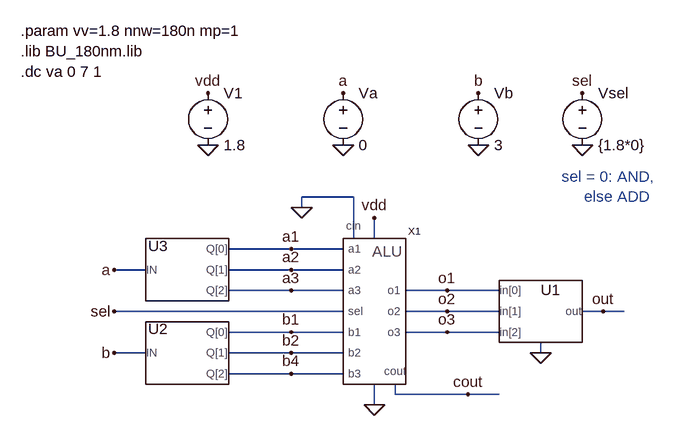
[diagram p0: schematic alu_test_dc.asc]
alu_test_dc.asc, the LTspice schematic file:
Version 4
SHEET 1 936 680
WIRE 368 64 288 64
WIRE 288 80 288 64
WIRE 368 128 368 64
WIRE 400 128 400 96
WIRE 272 144 176 144
WIRE 352 144 272 144
WIRE 48 176 0 176
WIRE 272 176 176 176
WIRE 352 176 272 176
WIRE 272 208 176 208
WIRE 352 208 272 208
WIRE 512 208 448 208
WIRE 592 208 512 208
WIRE 352 240 0 240
WIRE 512 240 448 240
WIRE 592 240 512 240
WIRE 752 240 720 240
WIRE 784 240 752 240
WIRE 272 272 176 272
WIRE 352 272 272 272
WIRE 512 272 448 272
WIRE 592 272 512 272
WIRE 48 304 0 304
WIRE 272 304 176 304
WIRE 352 304 272 304
WIRE 656 304 656 288
WIRE 272 336 176 336
WIRE 352 336 272 336
WIRE 432 368 432 352
WIRE 544 368 432 368
WIRE 592 368 544 368
WIRE 400 384 400 352
FLAG 752 240 out
FLAG 400 96 vdd
FLAG 400 384 0
FLAG 144 -16 0
FLAG 352 -16 0
FLAG 560 -16 0
FLAG 144 -96 vdd
FLAG 352 -96 a
FLAG 560 -96 b
FLAG 0 176 a
FLAG 0 304 b
FLAG 720 -16 0
FLAG 720 -96 sel
FLAG 0 240 sel
FLAG 288 80 0
FLAG 544 368 cout
FLAG 512 208 o1
FLAG 512 240 o2
FLAG 512 272 o3
FLAG 272 144 a1
FLAG 272 176 a2
FLAG 272 208 a3
FLAG 272 272 b1
FLAG 272 304 b2
FLAG 272 336 b4
FLAG 656 304 0
SYMBOL alu 400 240 R0
SYMATTR InstName X1
SYMBOL Bin2Dec 656 240 R0
SYMATTR InstName U1
SYMATTR SpiceLine Vhigh={vv}
SYMBOL Dec2Bin 112 304 R0
SYMATTR InstName U2
SYMATTR SpiceLine Vhigh={vv}
SYMBOL Dec2Bin 112 176 R0
SYMATTR InstName U3
SYMATTR SpiceLine Vhigh={vv}
SYMBOL /voltage 144 -112 R0
SYMATTR InstName V1
SYMATTR Value 1.8
SYMBOL /voltage 352 -112 R0
SYMATTR InstName Va
SYMATTR Value 0
SYMBOL /voltage 560 -112 R0
SYMATTR InstName Vb
SYMATTR Value 3
SYMBOL /voltage 720 -112 R0
SYMATTR InstName Vsel
SYMATTR Value {1.8*0}
TEXT -144 -192 Left 2 !.param vv=1.8 nnw=180n mp=1\n.lib BU_180nm.lib\n.dc va 0 7 1
TEXT 688 32 Left 2 ;sel = 0: AND,\n     else ADD

The netlist it stands for:
* alu_test_dc.asc
XX1 vdd a1 a2 a3 b1 b2 b4 0 o1 o2 o3 sel cout 0 alu  ; pins vdd a1 a2 a3 b1 b2 b3 vss o1 o2 o3 sel cout cin
XU1 o1 o2 o3 out Bin2Dec Vhigh={vv}  ; pins in[0] in[1] in[2] out
XU2 b b1 b2 b4 Dec2Bin Vhigh={vv}  ; pins IN Q[0] Q[1] Q[2]
XU3 a a1 a2 a3 Dec2Bin Vhigh={vv}  ; pins IN Q[0] Q[1] Q[2]
V1 vdd 0 1.8
Va a 0 0
Vb b 0 3
Vsel sel 0 {1.8*0}
.param vv=1.8 nnw=180n mp=1
.lib BU_180nm.lib
.dc va 0 7 1
* sel = 0: AND,
*      else ADD
.lib alu.asc
.lib Bin2Dec.sub
.lib Dec2Bin.sub
.backanno
.end

* Results of the author's LTspice run, read from the files saved beside the schematic
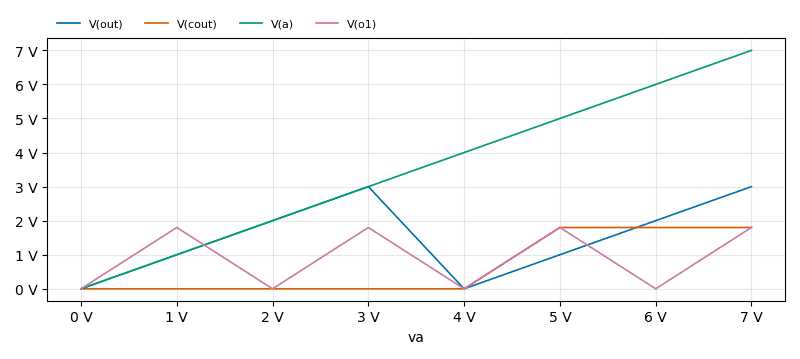
[diagram p1: DC transfer characteristic of alu_test_dc.asc, plotted from the saved traces]
* DC transfer characteristic, 1 run:
*   V(out): 0 V at va=0 V, 3 V at va=7 V, min 0 V, max 3 V
*   V(cout): 1.253 µV at va=0 V, 1.8 V at va=7 V, min 1.253 µV, max 1.8 V
*   V(a): 0 V at va=0 V, 7 V at va=7 V, min 0 V, max 7 V
*   V(o1): 1.253 µV at va=0 V, 1.8 V at va=7 V, min 1.253 µV, max 1.8 V